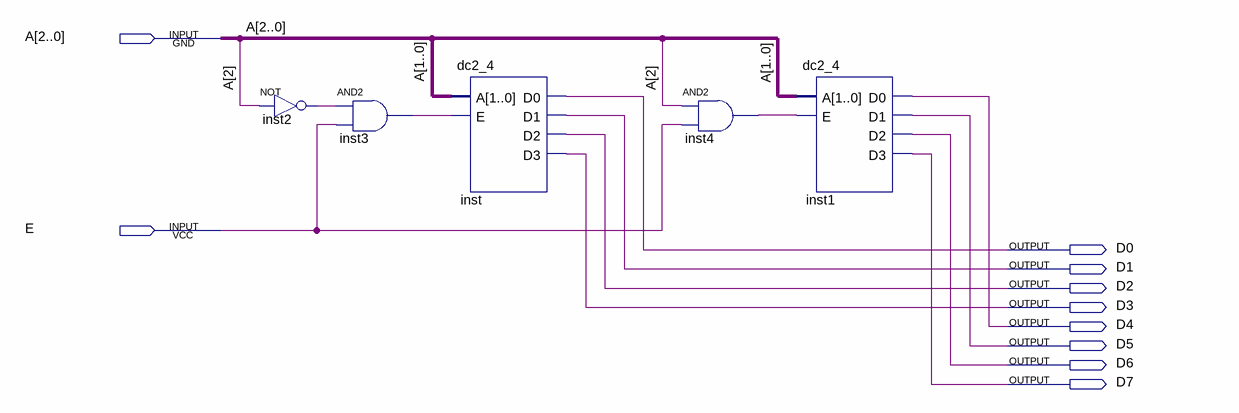
[diagram p0: schematic sheet]
// Quartus schematic dc3_8.bdf as structural Verilog: 5 symbols, 10 pins
module dc3_8 (
  input  [2:0] A,
  input  E,
  output D0,
  output D1,
  output D2,
  output D3,
  output D4,
  output D5,
  output D6,
  output D7
);

  wire inst2_out, inst3_out, inst4_out;

  not inst2 (inst2_out, A[2]);
  and inst3 (inst3_out, inst2_out, E);
  dc2_4 inst (.A(A[1:0]), .E(inst3_out), .D0(D0), .D1(D1), .D2(D2), .D3(D3));
  and inst4 (inst4_out, A[2], E);
  dc2_4 inst1 (.A(A[1:0]), .E(inst4_out), .D0(D4), .D1(D5), .D2(D6), .D3(D7));
endmodule
